# Altium schematic sheet Octal SPI Flash.SchDoc
size A3; Company Name: Renesas Electronics America; CompanyURL: www.renesas.com; PageSetup: Record=PageOptions|CenterHorizontal=True|CenterVertical=True|PrintScale=1.00|XCorrection=1.00|YCorrection=1.00|PrintKind=1|BorderSize=5000000|LeftOffset=0|BottomOffset=0|Orientation=2|PaperLength=1000|PaperWidth=1000|Scale=100|PaperSource=7|PrintQuality=-4|MediaType=1|DitherType=10|PaperKind=A5 148x210mm|PrintScaleMode=1; ReleaseDate: 16.09.2025; Version: MP; SheetNumber: 15; SheetTotal: 18; VariantNumber: 0; DSheetNumber: 1
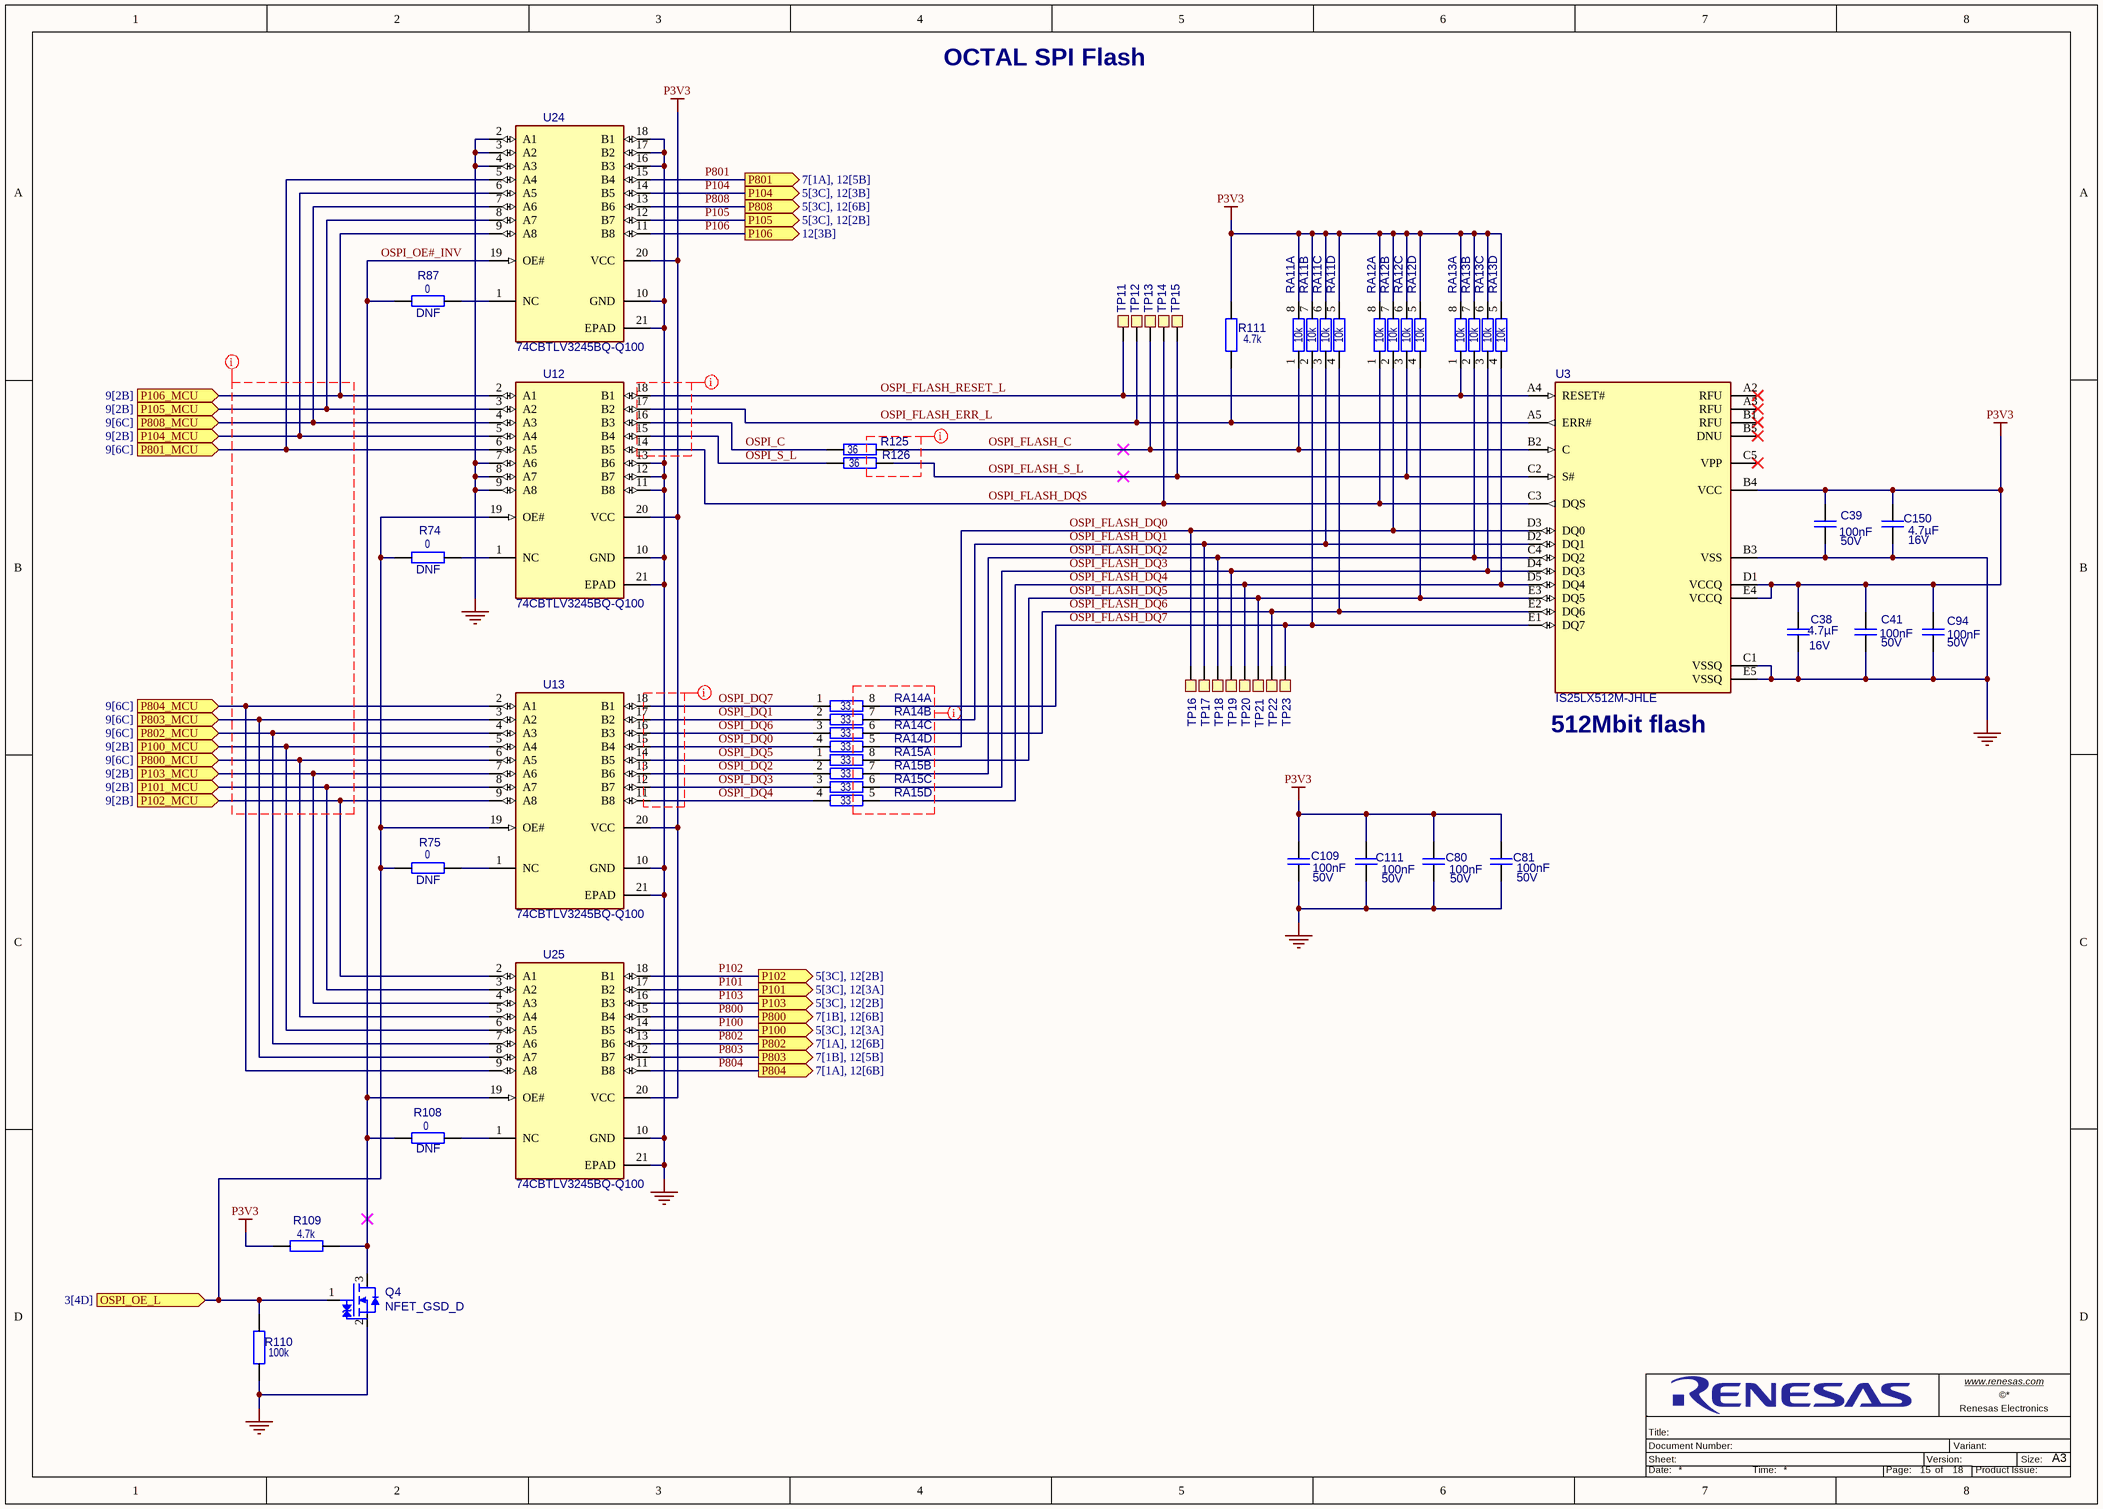
[diagram p0: Octal SPI Flash.SchDoc]

## Parts
C38  value 4.7µF  Operating Voltage Max: 16V  [C_EIA0402_0p7]  (hidden comment: KGM05CR51C475MH)
C39  value 100nF  Operating Voltage Max: 50V  [C_EIA0402_0p55]  (hidden comment: Capacitor)
C41  value 100nF  Operating Voltage Max: 50V  [C_EIA0402_0p55]  (hidden comment: Capacitor)
C80  value 100nF  Operating Voltage Max: 50V  [C_EIA0402_0p55]  (hidden comment: Capacitor)
C81  value 100nF  Operating Voltage Max: 50V  [C_EIA0402_0p55]  (hidden comment: Capacitor)
C94  value 100nF  Operating Voltage Max: 50V  [C_EIA0402_0p55]  (hidden comment: Capacitor)
C109  value 100nF  Operating Voltage Max: 50V  [C_EIA0402_0p55]  (hidden comment: Capacitor)
C111  value 100nF  Operating Voltage Max: 50V  [C_EIA0402_0p55]  (hidden comment: Capacitor)
C150  value 4.7µF  Operating Voltage Max: 16V  [C_EIA0402_0p7]  (hidden comment: KGM05CR51C475MH)
Q4  NFET_GSD_D  [roh_SOT-416FL_SC-89]
R74  value 0  [R_EIA0402]  (hidden comment: Resistor)
R75  value 0  [R_EIA0402]  (hidden comment: Resistor)
R87  value 0  [R_EIA0402]  (hidden comment: Resistor)
R108  value 0  [R_EIA0402]  (hidden comment: Resistor)
R109  value 4.7k  [R_EIA0402]  (hidden comment: Resistor)
R110  value 100k  [R_EIA0402]  (hidden comment: Resistor)
R111  value 4.7k  [R_EIA0402]  (hidden comment: Resistor)
R125  value 36  [R_EIA0402]  (hidden comment: Resistor)
R126  value 36  [R_EIA0402]  (hidden comment: Resistor)
RA11  value 10k  [R_Array_EIA0804]  (hidden comment: Resistor_Array)  (parts A,B,C,D of 4)
RA12  value 10k  [R_Array_EIA0804]  (hidden comment: Resistor_Array)  (parts A,B,C,D of 4)
RA13  value 10k  [R_Array_EIA0804]  (hidden comment: Resistor_Array)  (parts A,B,C,D of 4)
RA14  value 33  [R_Array_EIA0804]  (hidden comment: Resistor_Array)  (parts A,B,C,D of 4)
RA15  value 33  [R_Array_EIA0804]  (hidden comment: Resistor_Array)  (parts A,B,C,D of 4)
TP11  TP_VIA_0p45_0p15  [TP_VIA_0p45_0p15]  (value not drawn)  (no BOM)
TP12  TP_VIA_0p45_0p15  [TP_VIA_0p45_0p15]  (value not drawn)  (no BOM)
TP13  TP_VIA_0p45_0p15  [TP_VIA_0p45_0p15]  (value not drawn)  (no BOM)
TP14  TP_VIA_0p45_0p15  [TP_VIA_0p45_0p15]  (value not drawn)  (no BOM)
TP15  TP_VIA_0p45_0p15  [TP_VIA_0p45_0p15]  (value not drawn)  (no BOM)
TP16  TP_VIA_0p45_0p15  [TP_VIA_0p45_0p15]  (value not drawn)  (no BOM)
TP17  TP_VIA_0p45_0p15  [TP_VIA_0p45_0p15]  (value not drawn)  (no BOM)
TP18  TP_VIA_0p45_0p15  [TP_VIA_0p45_0p15]  (value not drawn)  (no BOM)
TP19  TP_VIA_0p45_0p15  [TP_VIA_0p45_0p15]  (value not drawn)  (no BOM)
TP20  TP_VIA_0p45_0p15  [TP_VIA_0p45_0p15]  (value not drawn)  (no BOM)
TP21  TP_VIA_0p45_0p15  [TP_VIA_0p45_0p15]  (value not drawn)  (no BOM)
TP22  TP_VIA_0p45_0p15  [TP_VIA_0p45_0p15]  (value not drawn)  (no BOM)
TP23  TP_VIA_0p45_0p15  [TP_VIA_0p45_0p15]  (value not drawn)  (no BOM)
U3  IS25LX512M-JHLE  [isi_TFBGA-24_8x6]
U12  74CBTLV3245BQ-Q100  [nex_SOT-764-1_DHVQFN20]
U13  74CBTLV3245BQ-Q100  [nex_SOT-764-1_DHVQFN20]
U24  74CBTLV3245BQ-Q100  [nex_SOT-764-1_DHVQFN20]
U25  74CBTLV3245BQ-Q100  [nex_SOT-764-1_DHVQFN20]

## Ports
OSPI_OE_L (in, see 3[4D]), P100 (out, see 5[3C], 12[3A]), P100_MCU (in, see 9[2B]), P101 (out, see 5[3C], 12[3A]), P101_MCU (in, see 9[2B]), P102 (out, see 5[3C], 12[2B]), P102_MCU (in, see 9[2B]), P103 (out, see 5[3C], 12[2B]), P103_MCU (in, see 9[2B]), P104 (out, see 5[3C], 12[3B]), P104_MCU (in, see 9[2B]), P105 (out, see 5[3C], 12[2B]), P105_MCU (in, see 9[2B]), P106 (out, see 12[3B]), P106_MCU (in, see 9[2B]), P800 (out, see 7[1B], 12[6B]), P800_MCU (in, see 9[6C]), P801 (out, see 7[1A], 12[5B]), P801_MCU (in, see 9[6C]), P802 (out, see 7[1A], 12[6B]), P802_MCU (in, see 9[6C]), P803 (out, see 7[1B], 12[5B]), P803_MCU (in, see 9[6C]), P804 (out, see 7[1A], 12[6B]), P804_MCU (in, see 9[6C]), P808 (out, see 5[3C], 12[6B]), P808_MCU (in, see 9[6C])

## Nets
GND: C38.2 C39.2 C41.2 C80.2 C81.2 C94.2 C109.2 C111.2 C150.2 Q4.2(Source) R110.1 U3.B3(VSS) U3.C1(VSSQ) U3.E5(VSSQ) U12.7(A6) U12.8(A7) U12.9(A8) U12.10(GND) U12.11(B8) U12.12(B7) U12.13(B6) U12.21(EPAD) U13.10(GND) U13.21(EPAD) U24.2(A1) U24.3(A2) U24.4(A3) U24.10(GND) U24.16(B3) U24.17(B2) U24.18(B1) U24.21(EPAD) U25.10(GND) U25.21(EPAD)
P3V3: C38.1 C39.1 C41.1 C80.1 C81.1 C94.1 C109.1 C111.1 C150.1 R109.1 R111.2 RA11.5 RA11.6 RA11.7 RA11.8 RA12.5 RA12.6 RA12.7 RA12.8 RA13.5 RA13.6 RA13.7 RA13.8 U3.B4(VCC) U3.D1(VCCQ) U3.E4(VCCQ) U12.20(VCC) U13.20(VCC) U24.20(VCC) U25.20(VCC)
OSPI_C: R125.1 U12.16(B3)
OSPI_DQ0: RA14.4 U13.15(B4)
OSPI_DQ1: RA14.2 U13.17(B2)
OSPI_DQ2: RA15.2 U13.13(B6)
OSPI_DQ3: RA15.3 U13.12(B7)
OSPI_DQ4: RA15.4 U13.11(B8)
OSPI_DQ5: RA15.1 U13.14(B5)
OSPI_DQ6: RA14.3 U13.16(B3)
OSPI_DQ7: RA14.1 U13.18(B1)
OSPI_FLASH_C: R125.2 RA11.1 TP13.1 U3.B2(C)
OSPI_FLASH_DQ0: RA12.2 RA14.5 TP16.1 U3.D3(DQ0)
OSPI_FLASH_DQ1: RA11.3 RA14.7 TP17.1 U3.D2(DQ1)
OSPI_FLASH_DQ2: RA13.2 RA15.7 TP18.1 U3.C4(DQ2)
OSPI_FLASH_DQ3: RA13.3 RA15.6 TP19.1 U3.D4(DQ3)
OSPI_FLASH_DQ4: RA13.4 RA15.5 TP20.1 U3.D5(DQ4)
OSPI_FLASH_DQ5: RA12.4 RA15.8 TP21.1 U3.E3(DQ5)
OSPI_FLASH_DQ6: RA11.4 RA14.6 TP22.1 U3.E2(DQ6)
OSPI_FLASH_DQ7: RA11.2 RA14.8 TP23.1 U3.E1(DQ7)
OSPI_FLASH_DQS: RA12.1 TP14.1 U3.C3(DQS) U12.14(B5)
OSPI_FLASH_ERR_L: R111.1 TP12.1 U3.A5(ERR#) U12.17(B2)
OSPI_FLASH_RESET_L: RA13.1 TP11.1 U3.A4(RESET#) U12.18(B1)
OSPI_FLASH_S_L: R126.2 RA12.3 TP15.1 U3.C2(S#)
OSPI_OE#_INV: Q4.3(Drain) R87.1 R108.1 R109.2 U24.19(OE#) U25.19(OE#)
OSPI_OE_L: Q4.1(Gate) R74.1 R75.1 R110.2 U12.19(OE#) U13.19(OE#) ; port OSPI_OE_L
OSPI_S_L: R126.1 U12.15(B4)
P100: U25.14(B5) ; port P100
P100_MCU: U13.5(A4) U25.6(A5) ; port P100_MCU
P101: U25.17(B2) ; port P101
P101_MCU: U13.8(A7) U25.3(A2) ; port P101_MCU
P102: U25.18(B1) ; port P102
P102_MCU: U13.9(A8) U25.2(A1) ; port P102_MCU
P103: U25.16(B3) ; port P103
P103_MCU: U13.7(A6) U25.4(A3) ; port P103_MCU
P104: U24.14(B5) ; port P104
P104_MCU: U12.5(A4) U24.6(A5) ; port P104_MCU
P105: U24.12(B7) ; port P105
P105_MCU: U12.3(A2) U24.8(A7) ; port P105_MCU
P106: U24.11(B8) ; port P106
P106_MCU: U12.2(A1) U24.9(A8) ; port P106_MCU
P800: U25.15(B4) ; port P800
P800_MCU: U13.6(A5) U25.5(A4) ; port P800_MCU
P801: U24.15(B4) ; port P801
P801_MCU: U12.6(A5) U24.5(A4) ; port P801_MCU
P802: U25.13(B6) ; port P802
P802_MCU: U13.4(A3) U25.7(A6) ; port P802_MCU
P803: U25.12(B7) ; port P803
P803_MCU: U13.3(A2) U25.8(A7) ; port P803_MCU
P804: U25.11(B8) ; port P804
P804_MCU: U13.2(A1) U25.9(A8) ; port P804_MCU
P808: U24.13(B6) ; port P808
P808_MCU: U12.4(A3) U24.7(A6) ; port P808_MCU
NetR74_2: R74.2 U12.1(NC)
NetR75_2: R75.2 U13.1(NC)
NetR87_2: R87.2 U24.1(NC)
NetR108_2: R108.2 U25.1(NC)

Not connected (* = marked no-connect by the designer): U3 A2(RFU)* A3(RFU)* B1(RFU)* B5(DNU)* C5(VPP)*

## Layout directives
net class OSPI_MCU: (no net found under the mark)
net class OSPI: (no net found under the mark)

## Notes on the sheet
- OCTAL SPI Flash
- (near U3) 512Mbit flash
- www.renesas.com <http://www.renesas.com>
- Sheet:
- Title:
- Document Number:
- Version:
- Variant:
- Renesas Electronics
- Size:
- A3
- Date:
- Time:
- Page:
- of
- Product Issue:

## Library data of the parts
C38 C150 = CAP-00000022-3: Capacitor, EIA0402, 4.7u, 16V, X5R; Tolerance: 20%; Subtype: MLCC; Height: 700µm; Dielectric: X5R; Operating Temperature Min: -55°C; Qualification: -; Operating Temperature Max: 85°C
C39 C41 C80 C81 C94 C109 C111 = CAP-00003203-9: Capacitor,EIA0402,100n,50V,X7R; Tolerance: 10%; Qualification: AEC-Q200; Subtype: MLCC; Dielectric: X7R; Height: 550µm; Operating Temperature Max: 125°C; Operating Temperature Min: -55°C
Q4 = TRA-00000001-2: N-Channel 60V 250mA Small Signal MOSFET; DC Resistance: 2.4; Gate Voltage Threshold Max: 2.3V; Gate Voltage Threshold Min: 1V; Input Capacitance: 15pF; Power: 150mW; Subtype: NMOS; Current: 250mA; Operating Temperature Max: 150°C; Operating Temperature Min: -55°C; Operating Voltage Max: 60V; Pin Count: 3; Qualification: -
R74 R75 R87 R108 = RES-00000801-9: Resistor,EIA0402,0,0.0625W; Power: 62.5mW; Tolerance: 5%; Subtype: Chip Resistor; Operating Temperature Max: 155°C; Operating Temperature Min: -55°C; Qualification: -; DNF: DNF
R109 R111 = RES-00000894-9: Resistor,EIA0402,4.7k,0.0625W; Power: 62.5mW; Tolerance: 1%; Subtype: Chip Resistor; Operating Temperature Max: 155°C; Operating Temperature Min: -55°C; Qualification: -
R110 = RES-00000926-9: Resistor,EIA0402,100k,0.0625W; Power: 62.5mW; Tolerance: 1%; Subtype: Chip Resistor; Operating Temperature Max: 155°C; Operating Temperature Min: -55°C; Qualification: -
R125 R126 = RES-00000843-9: Resistor,EIA0402,36,0.0625W; Power: 62.5mW; Tolerance: 1%; Subtype: Chip Resistor; Operating Temperature Max: 155°C; Operating Temperature Min: -55°C; Qualification: -
  R125: Parameter 1: *
RA11-RA13 = RES-00003206-7: Resistor Network & Array,0804, 10k,0.0625W; Power: 62.5mW; Tolerance: 1%; Qualification: AEC-Q200; Subtype: Resistor Array; Operating Temperature Max: 155°C; Operating Temperature Min: -55°C
RA14 RA15 = RES-00003457-16: Resistor Network & Array,0804,33,0.0625W; Power: 62.5mW; Tolerance: 1%; Qualification: AEC-Q200; Subtype: Resistor Array; Temperature Coefficient: 200ppm; Operating Temperature Max: 155°C; Operating Temperature Min: -55°C
TP11-TP23 = MIS-00003461-11: Testpoint,THT,0.45mm PTH; Value: TP; Subtype: Testpoint; Qualification: -; Pin Count: 1
U3 = ICS-00000135-4: NOR Flash 512Mb, Octal Flash, 3V, 24-ball TFBGA; Operating Voltage Max: 3.6V; Subtype: Digital; Operating Voltage Min: 2.7V; Current: 13mA; Frequency: 133MHz; Pin Count: 24; Operating Temperature Min: -40°C; Qualification: -; Operating Temperature Max: 105°C
U12 U13 U24 U25 = ICS-00000017-5: Octal FET Bus Switch, 5 ohm, 0.3ns max delay, DHVQFN20; Current: 128mA; Operating Voltage Max: 3.6V; Operating Voltage Min: 2.3V; Output Voltage Min: 0V; Qualification: AEC-Q100; Operating Temperature Max: 125°C; Operating Temperature Min: -40°C; Output Voltage Max: 3.6V; Pin Count: 21; Subtype: Bus Switch